# EAGLE design RPI_CAN (EAGLE 9.3.2)
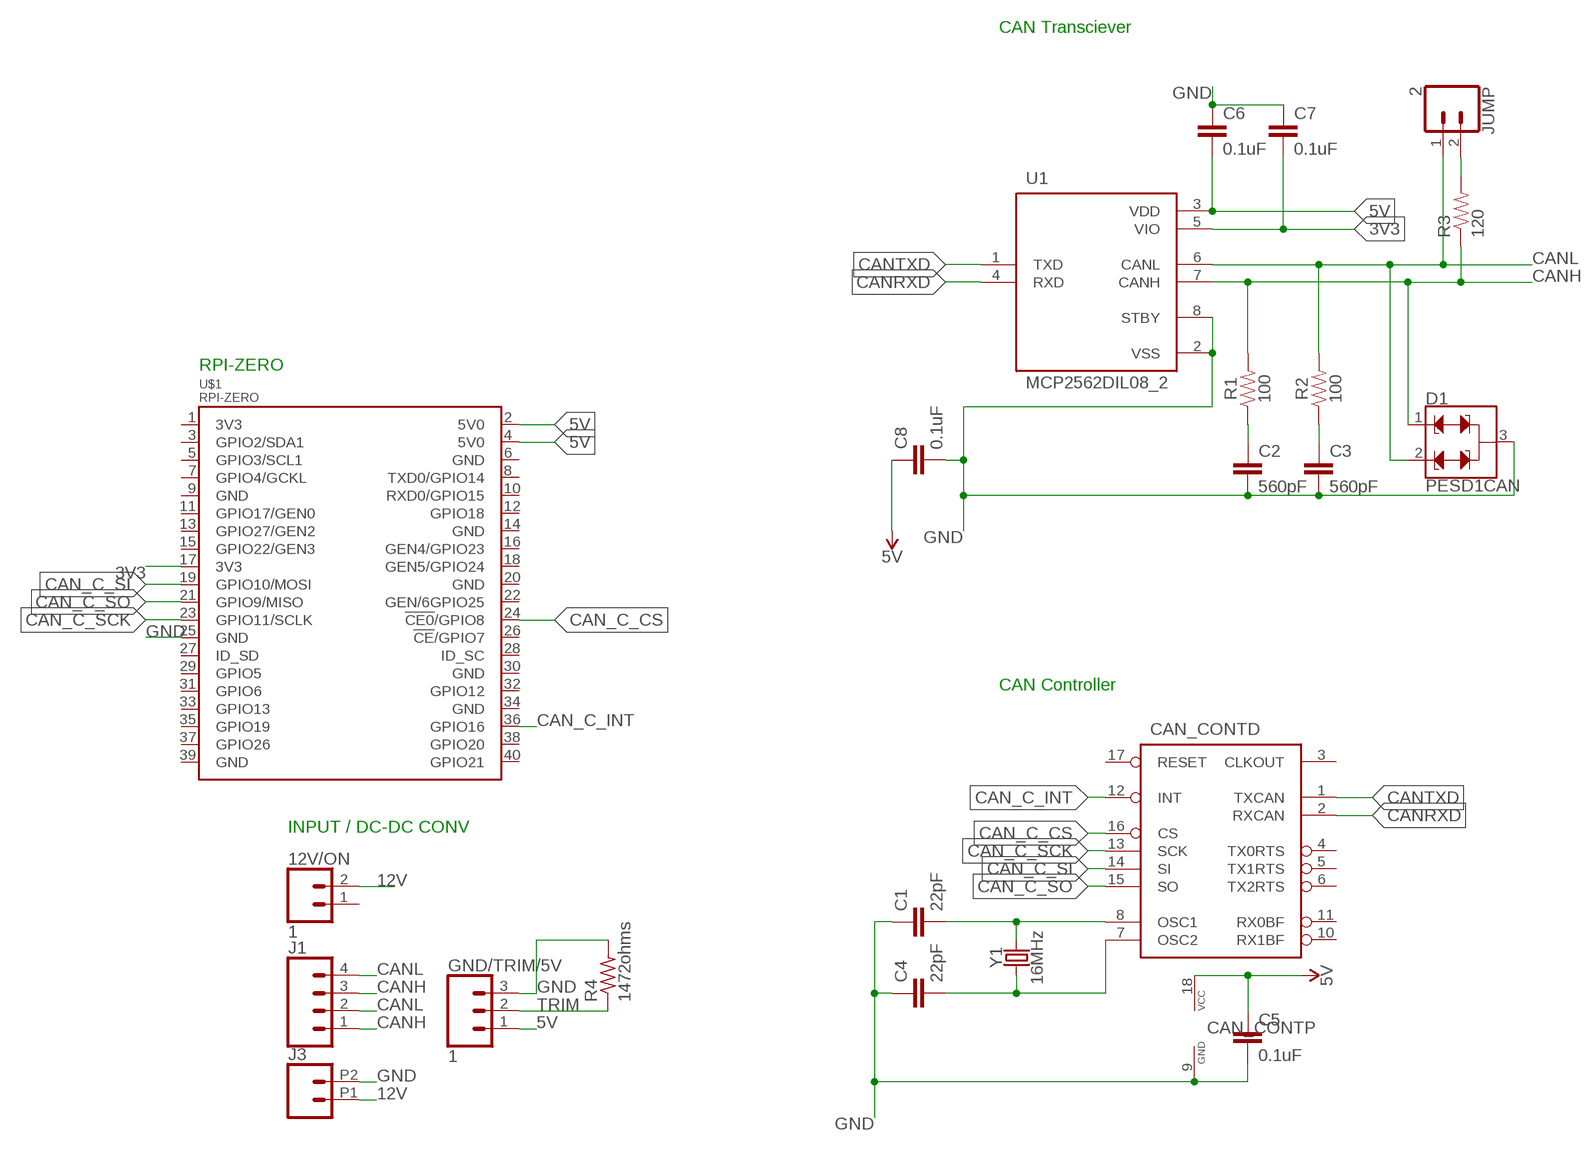
[diagram p0: schematic, sheet 1]

## Parts
12V/ON  1  CONN_02  [1X02]
C1  22pF  CAPKIT  [CAP-PTH-SMALL-KIT]
C2  560pF  CAPKIT  [CAP-PTH-SMALL-KIT]
C3  560pF  CAPKIT  [CAP-PTH-SMALL-KIT]
C4  22pF  CAPKIT  [CAP-PTH-SMALL-KIT]
C5  0.1uF  CAPKIT  [CAP-PTH-SMALL-KIT]
C6  0.1uF  CAPKIT  [CAP-PTH-SMALL-KIT]
C7  0.1uF  CAPKIT  [CAP-PTH-SMALL-KIT]
C8  0.1uF  CAPKIT  [CAP-PTH-SMALL-KIT]
CAN_CONT  MCP2515P  [DIL18]
D1  PESD1CAN  [SOT23-3]
GND/TRIM/5V  1  CONN_03  [1X03]
J1  CONN_04  [1X04]
J3  CONN_022.54MM_SCREWTERM  [1X02_2.54_SCREWTERM]
JUMP  2  CONN_02  [1X02]
R1  100  100OHM-HORIZ_KIT-1/4W-1%  [AXIAL-0.3EZ]
R2  100  100OHM-HORIZ_KIT-1/4W-1%  [AXIAL-0.3EZ]
R3  120  RESISTORAXIAL-0.3  [AXIAL-0.3]
R4  1472ohms  R-US_0204/5  [0204/5]
U1  MCP2562DIL08_2  [DIL08]
U$1  RPI-ZERO  [RASP_PI_ZERO_BOARD_FULL]
Y1  16MHz  CRYSTAL-16MHZPTH-HC49US  [HC49US]

## Nets
3V3: C7.2 U1.5(VIO) U$1.17(3V3)
5V: C5.1 C6.2 C8.1 CAN_CONT.18(P:VCC) GND/TRIM/5V.1 U1.3(VDD) U$1.2(5V0) U$1.4(5V0)
12V: 12V/ON.2 J3.P1
CAN_C_CS: CAN_CONT.16(D:CS) U$1.24(!CE0!/GPIO8)
CAN_C_INT: CAN_CONT.12(D:INT) U$1.36(GPIO16)
CAN_C_SCK: CAN_CONT.13(D:SCK) U$1.23(GPIO11/SCLK)
CAN_C_SI: CAN_CONT.14(D:SI) U$1.19(GPIO10/MOSI)
CAN_C_SO: CAN_CONT.15(D:SO) U$1.21(GPIO9/MISO)
CANH: D1.1 J1.1 J1.3 R1.P$2 R3.P$1 U1.7(CANH)
CANL: D1.2 J1.2 J1.4 JUMP.1 R2.P$2 U1.6(CANL)
CANRXD: CAN_CONT.2(D:RXCAN) U1.4(RXD)
CANTXD: CAN_CONT.1(D:TXCAN) U1.1(TXD)
GND: C1.1 C2.2 C3.2 C4.1 C5.2 C6.1 C7.1 C8.2 CAN_CONT.9(P:GND) D1.3 GND/TRIM/5V.3 J3.P2 R4.2 U1.2(VSS) U1.8(STBY) U$1.25(GND)
N$1: JUMP.2 R3.P$2
N$3: C2.1 R1.P$1
N$4: C3.1 R2.P$1
N$5: C1.2 CAN_CONT.8(D:OSC1) Y1.2
N$6: C4.2 CAN_CONT.7(D:OSC2) Y1.1
TRIM: GND/TRIM/5V.2 R4.1
Unconnected: 12V/ON.1 CAN_CONT.3(D:CLKOUT) CAN_CONT.4(D:TX0RTS) CAN_CONT.5(D:TX1RTS) CAN_CONT.6(D:TX2RTS) CAN_CONT.10(D:RX1BF) CAN_CONT.11(D:RX0BF) CAN_CONT.17(D:RESET) U$1.1(3V3) U$1.3(GPIO2/SDA1) U$1.5(GPIO3/SCL1) U$1.6(GND) U$1.7(GPIO4/GCKL) U$1.8(TXD0/GPIO14) U$1.9(GND) U$1.10(RXD0/GPIO15) U$1.11(GPIO17/GEN0) U$1.12(GPIO18) U$1.13(GPIO27/GEN2) U$1.14(GND) U$1.15(GPIO22/GEN3) U$1.16(GEN4/GPIO23) U$1.18(GEN5/GPIO24) U$1.20(GND) U$1.22(GEN/6GPIO25) U$1.26(!CE!/GPIO7) U$1.27(ID_SD) U$1.28(ID_SC) U$1.29(GPIO5) U$1.30(GND) U$1.31(GPIO6) U$1.32(GPIO12) U$1.33(GPIO13) U$1.34(GND) U$1.35(GPIO19) U$1.37(GPIO26) U$1.38(GPIO20) U$1.39(GND) U$1.40(GPIO21)

## Notes on the sheet
- CAN Transciever
- RPI-ZERO
- CAN Controller
- INPUT / DC-DC CONV

## Library data of the parts
12V/ON J3 JUMP = SparkFun-Connectors:CONN_02: Multi connection point. Often used as Generic Header-pin footprint for 0.1 inch spaced/style header connections On any of the 0.1 inch spaced packages, you can populate with these: Break Away Headers - Straight <https://www.sparkfun.com/products/116> (PRT-00116) Break Away Male Headers - Right Angle <https://www.sparkfun.com/products/553> (PRT-00553) Female Headers <https://www.sparkfun.com/products/115> (PRT-00115) Break Away Headers - Machine Pin <https://www.sparkfun.com/products/117> (PRT-00117) Break Away Female Headers - Swiss Machine Pin <https://www.sparkfun.com/products/743> (PRT-00743) For SCREWTERMINALS and SPRING TERMINALS visit here: Screw Terimnals on SparkFun.com <https://www.sparkfun.com/search/results?term=Screw+Terminals> (5mm/3.5mm/2.54mm spacing) This device is also useful as a general connection point to wire up your design to another part of your project. Our various solder wires solder well into these plated through hole pads. Hook-Up Wire - Assortment (Stranded, 22 AWG) <https://www.sparkfun.com/products/11375> (PRT-11375) Hook-Up Wire - Assortment (Solid Core, 22 AWG) <https://www.sparkfun.com/products/11367> (PRT-11367) View the entire wire category on our website here <https://www.sparkfun.com/categories/141> Special notes: Molex polarized connector foot print use with: PRT-08233 with associated crimp pins and housings. 2.54_SCREWTERM for use with PRT-10571. 3.5mm Screw Terminal footprints for PRT-08084 5mm Screw Terminal footprints for use with PRT-08432
C1-C8 = SparkFun:CAP: Capacitor Standard 0603 ceramic capacitor, and 0.1" leaded capacitor.
CAN_CONT = can:MCP2515: MC2515 Stand-Alone CAN Controller With SPI Interface, Microchip
D1 = SparkFun-DiscreteSemi:PESD1CAN: CAN bus ESD protection diode PESD1CAN is used to protect two CAN bus lines from ESD. Link to datasheet <http://www.nxp.com/documents/data_sheet/PESD1CAN-U.pdf> SparkFun Products: SparkFun CAN-BUS Shield <https://www.sparkfun.com/products/13262>; PROD_ID: DIO-12501
GND/TRIM/5V = SparkFun-Connectors:CONN_03: Multi connection point. Often used as Generic Header-pin footprint for 0.1 inch spaced/style header connections On any of the 0.1 inch spaced packages, you can populate with these: Break Away Headers - Straight <https://www.sparkfun.com/products/116> (PRT-00116) Break Away Male Headers - Right Angle <https://www.sparkfun.com/products/553> (PRT-00553) Female Headers <https://www.sparkfun.com/products/115> (PRT-00115) Break Away Headers - Machine Pin <https://www.sparkfun.com/products/117> (PRT-00117) Break Away Female Headers - Swiss Machine Pin <https://www.sparkfun.com/products/743> (PRT-00743) Stackable Header - 3 Pin (Female, 0.1") <https://www.sparkfun.com/products/13875> (PRT-13875) For SCREWTERMINALS and SPRING TERMINALS visit here: Screw Terimnals on SparkFun.com <https://www.sparkfun.com/search/results?term=Screw+Terminals> (5mm/3.5mm/2.54mm spacing) This device is also useful as a general connection point to wire up your design to another part of your project. Our various solder wires solder well into these plated through hole pads. Hook-Up Wire - Assortment (Stranded, 22 AWG) <https://www.sparkfun.com/products/11375> (PRT-11375) Hook-Up Wire - Assortment (Solid Core, 22 AWG) <https://www.sparkfun.com/products/11367> (PRT-11367) View the entire wire category on our website here <https://www.sparkfun.com/categories/141> Special notes: Molex polarized connector foot print use with SKU : PRT-08232 with associated crimp pins and housings.
J1 = SparkFun-Connectors:CONN_04: Multi connection point. Often used as Generic Header-pin footprint for 0.1 inch spaced/style header connections On any of the 0.1 inch spaced packages, you can populate with these: Break Away Headers - Straight <https://www.sparkfun.com/products/116> (PRT-00116) Break Away Male Headers - Right Angle <https://www.sparkfun.com/products/553> (PRT-00553) Female Headers <https://www.sparkfun.com/products/115> (PRT-00115) Break Away Headers - Machine Pin <https://www.sparkfun.com/products/117> (PRT-00117) Break Away Female Headers - Swiss Machine Pin <https://www.sparkfun.com/products/743> (PRT-00743) For SCREWTERMINALS and SPRING TERMINALS visit here: Screw Terimnals on SparkFun.com <https://www.sparkfun.com/search/results?term=Screw+Terminals> (5mm/3.5mm/2.54mm spacing) This device is also useful as a general connection point to wire up your design to another part of your project. Our various solder wires solder well into these plated through hole pads. Hook-Up Wire - Assortment (Stranded, 22 AWG) <https://www.sparkfun.com/products/11375> (PRT-11375) Hook-Up Wire - Assortment (Solid Core, 22 AWG) <https://www.sparkfun.com/products/11367> (PRT-11367) View the entire wire category on our website here <https://www.sparkfun.com/categories/141> Special notes: Molex polarized connector foot print use with SKU : PRT-08231 with associated crimp pins and housings. 1MM SMD Version SKU: PRT-10208; PROD_ID: CONN-09696
R1 R2 = SparkFun-Resistors:100OHM: 100Ω resistor A resistor is a passive two-terminal electrical component that implements electrical resistance as a circuit element. Resistors act to reduce current flow, and, at the same time, act to lower voltage levels within circuits. - Wikipedia; PROD_ID: RES-12181
R3 = SparkFun:RESISTOR: Resistor Basic schematic elements and footprints for 0603, 1206, and PTH resistors.
R4 = adafruit:R-US_: RESISTOR, American symbol
U1 = can:MCP2562
U$1 = rpi-zero:RPI-ZERO
Y1 = SparkFun-Clocks:CRYSTAL-16MHZ: 16MHz Crystal Digikey Example <http://www.digikey.com/product-search/en?keywords=535-9122-1-ND> Frequency: 16MHz Frequency Stability: ±50ppm Frequency Tolerance: ±20ppm Load Capacitance: 18pF SparkFun Products: Pro Micro -5V/16MHz <https://www.sparkfun.com/products/12640> SparkFun Serial Enabled LCD Kit <https://www.sparkfun.com/products/10097>; PROD_ID: XTAL-08181; SF_ID: COM-00536

## Board
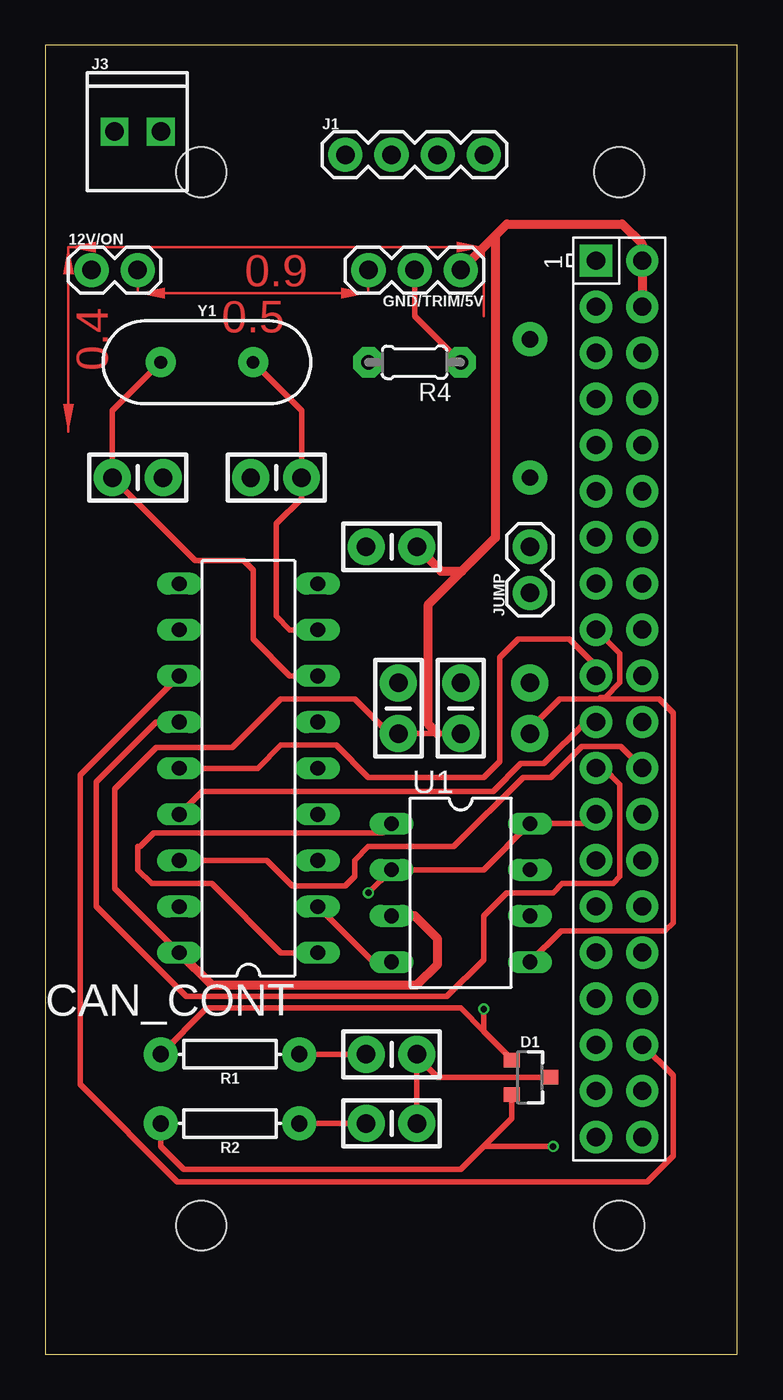
[diagram p1: board, top side]
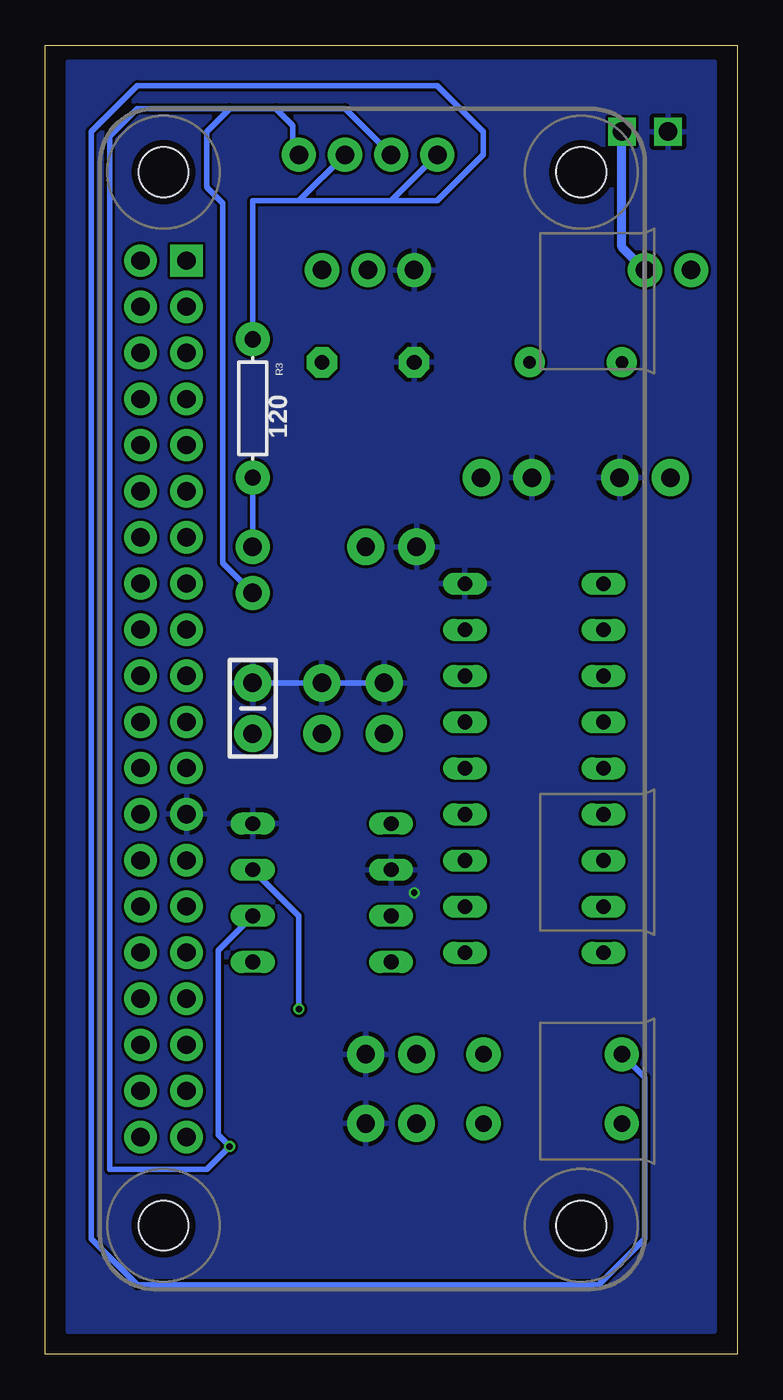
[diagram p2: board, bottom side, seen from below]

Size 38.08 x 72.06 mm. Coordinates in mm from the lower left corner, seen from the top.
Outline: 0,0 38.08,0 38.08,72.06 0,72.06 0,0
Copper layers (1*16): Top 0.035559375mm / dielectric 1.6mm / Bottom 0.035559375mm
Design rules "oshpark_2layer": minimum track width 6mil, minimum drill 10mil, track to track 6mil, track to pad 6mil, pad to pad 6mil, via to via 6mil, smd to smd 6mil, copper to edge 15mil, drill to drill 6mil, minimum pad ring 5mil, minimum via ring 5mil, stop-mask expansion 2.5mil, vias tented up to drill 0mil, thermal gap 10mil

### Footprints (pad centres in the part's own frame; a part is rotated, then mirrored left to right if it is on the bottom)
1X02 = drill 1.016 pad 1.88: 1 0,0; 2 2.54,0
CAP-PTH-SMALL-KIT = drill 1.016 pad 2.032: 1 -1.397,0; 2 1.397,0
DIL18 = drill 0.813 long: 1 -10.16,-3.81; 2 -7.62,-3.81; 3 -5.08,-3.81; 4 -2.54,-3.81; 5 0,-3.81; 6 2.54,-3.81; 7 5.08,-3.81; 8 7.62,-3.81; 9 10.16,-3.81; 10 10.16,3.81; 11 7.62,3.81; 12 5.08,3.81; 13 2.54,3.81; 14 0,3.81; 15 -2.54,3.81; 16 -5.08,3.81; 17 -7.62,3.81; 18 -10.16,3.81
SOT23-3 = smd 0.8 x 0.9: 1 -0.95,-1; 2 0.95,-1; 3 0,1.1
1X03 = drill 1.016 pad 1.88: 1 0,0; 2 2.54,0; 3 5.08,0
1X04 = drill 1.016 pad 1.88: 1 0,0; 2 2.54,0; 3 5.08,0; 4 7.62,0
1X02_2.54_SCREWTERM = drill 1.016 square: P1 2.54,0; P2 0,0
AXIAL-0.3EZ = drill 0.9 pad 1.88: P$1 -3.81,0; P$2 3.81,0
AXIAL-0.3 = drill 0.9 pad 1.88: P$1 -3.81,0; P$2 3.81,0
0204/5 = drill 0.813 pad 1.676 octagon: 1 -2.54,0; 2 2.54,0
DIL08 = drill 0.813 long: 1 -3.81,-3.81; 2 -1.27,-3.81; 3 1.27,-3.81; 4 3.81,-3.81; 5 3.81,3.81; 6 1.27,3.81; 7 -1.27,3.81; 8 -3.81,3.81
RASP_PI_ZERO_BOARD_FULL = drill 1 pad 1.778 square: 1 8.37,25.23 | drill 1 pad 1.778: 2 8.37,27.77; 3 10.91,25.23; 4 10.91,27.77; 5 13.45,25.23; 6 13.45,27.77; 7 15.99,25.23; 8 15.99,27.77; 9 18.53,25.23; 10 18.53,27.77; 11 21.07,25.23; 12 21.07,27.77; 13 23.61,25.23; 14 23.61,27.77; 15 26.15,25.23; 16 26.15,27.77; 17 28.69,25.23; 18 28.69,27.77; 19 31.23,25.23; 20 31.23,27.77; 21 33.77,25.23; 22 33.77,27.77; 23 36.31,25.23; 24 36.31,27.77; 25 38.85,25.23; 26 38.85,27.77; 27 41.39,25.23; 28 41.39,27.77; 29 43.93,25.23; 30 43.93,27.77; 31 46.47,25.23; 32 46.47,27.77; 33 49.01,25.23; 34 49.01,27.77; 35 51.55,25.23; 36 51.55,27.77; 37 54.09,25.23; 38 54.09,27.77; 39 56.63,25.23; 40 56.63,27.77 | hole 2.75: 3.5,3.5; 3.5,26.5; 61.5,3.5; 61.5,26.5
HC49US = drill 0.7 pad 1.651: 1 -2.54,0; 2 2.54,0

### Placement (x,y rotation side)
12V/ON  2.54,59.69 0 top
C1  12.7,48.26 0 top
C2  19.05,16.51 0 top
C3  19.05,12.7 0 top
C4  5.08,48.26 180 top
C5  22.86,35.56 90 top
C6  19.43,35.56 270 top
C7  26.67,35.56 270 bottom
C8  19.05,44.45 180 top
CAN_CONT  11.18,32.26 90 top
D1  26.67,15.24 270 top
GND/TRIM/5V  22.86,59.69 180 top
J1  16.51,66.04 0 top
J3  3.81,67.31 0 top
JUMP  26.67,41.91 90 top
R1  10.16,16.51 180 top
R2  10.16,12.7 180 top
R3  26.67,52.07 270 bottom
R4  20.32,54.61 180 top
U1  22.86,25.4 270 top
U$1  5.08,68.58 270 top
Y1  8.89,54.61 0 top

### Tracks (layer width: path | path; a pad name or v marks a point on that pad's centre or on a via)
3V3
  Top 0.305: U1.5 28.38,23.3 34.1,23.3 34.54,23.75 34.54,35.31 33.78,36.07 30.48,36.07 | 30.48,36.07 28.32,36.07 26.67,34.42 C7.2 | 30.48,36.07 30.57,36.16 30.8,36.16 31.62,36.98 31.62,38.58 U$1.17
5V
  Top 0.305: CAN_CONT.18 3.81,25.65 3.81,31.11 6.1,33.4 10.29,33.4 12.95,36.07 17.02,36.07 18.92,34.16 C6.2 21.59,34.16 C5.1
  Top 0.508: GND/TRIM/5V.1 24.77,61.59 | 24.77,61.59 25.4,62.23 31.75,62.23 32.85,61.13 U$1.2 U$1.4 | 24.77,61.59 24.77,44.96 22.92,43.12 | CAN_CONT.18 9.14,20.32 20.45,20.32 21.59,21.46 21.59,22.86 20.32,24.13 U1.3 | 22.92,43.12 21.08,41.27 21.08,34.67 21.59,34.16 | C8.1 21.78,43.12 22.92,43.12
12V
  Bottom 0.508: 12V/ON.2 6.35,60.96 J3.P1
CAN_C_CS
  Top 0.305: CAN_CONT.16 12.19,27.18 13.59,25.78 16.51,25.78 17.02,26.29 17.02,27.18 17.78,27.94 22.48,27.94 26.29,31.75 27.81,31.75 29.53,33.46 31.66,33.46 U$1.24
CAN_C_INT
  Top 0.305: CAN_CONT.12 1.91,31.88 1.91,14.86 7.27,9.5 33.12,9.5 34.54,10.92 34.54,15.34 U$1.36
CAN_C_SCK
  Top 0.305: CAN_CONT.13 6.1,34.8 2.79,31.5 2.79,24.64 7.75,19.68 22.1,19.68 24.13,21.72 24.13,24.13 25.4,25.4 27.94,25.4 28.45,25.91 31.24,25.91 31.62,26.29 31.62,31.37 30.72,32.27 U$1.23
CAN_C_SI
  Top 0.305: CAN_CONT.14 11.68,32.26 12.95,33.53 16,33.53 17.78,31.75 24.13,31.75 25.02,32.64 25.02,38.35 26.04,39.37 28.83,39.37 30.31,37.89 U$1.19
CAN_C_SO
  Top 0.305: CAN_CONT.15 8.64,30.99 24.64,30.99 26.16,32.51 27.43,32.51 29.73,34.81 U$1.21
CANH  (via drill 0.35)
  Top 0.305: R1.P$2 8.89,19.05 22.86,19.05 24.13,17.78 | 24.13,17.78 25.67,16.24 D1.1 | v24.13,19 24.13,17.78
  Bottom 0.305: R3.P$1 26.67,63.5 24.13,63.5 | U1.7 24.13,24.13 v24.13,19 | R1.P$2 5.08,15.24 5.08,6.35 7.62,3.81 33.02,3.81 35.56,6.35 35.56,67.31 33.02,69.85 16.51,69.85 13.97,67.31 13.97,66.04 16.51,63.5 19.05,63.5 | 24.13,63.5 19.05,63.5 | J1.1 19.05,63.5 | J1.3 24.13,63.5
CANL  (via drill 0.35)
  Top 0.305: R2.P$2 6.35,11.43 7.62,10.16 22.86,10.16 24.13,11.43 | D1.2 25.67,12.97 24.13,11.43 | v27.94,11.43 24.13,11.43
  Bottom 0.305: U1.6 28.57,22.23 28.57,12.06 v27.94,11.43 29.21,10.16 34.54,10.16 34.54,67.06 33.02,68.58 27.94,68.58 | JUMP.1 28.32,43.56 28.32,63.37 29.21,64.26 29.21,67.31 27.94,68.58 | 27.94,68.58 25.4,68.58 | 25.4,68.58 24.47,67.65 24.47,66.38 J1.4 | 25.4,68.58 21.59,68.58 J1.2
CANRXD
  Top 0.305: CAN_CONT.2 18.03,21.59 U1.4
CANTXD
  Top 0.305: CAN_CONT.1 12.95,22.1 9.14,25.91 5.84,25.91 5.08,26.67 5.08,27.94 5.21,27.94 5.97,28.7 18.54,28.7 U1.1
GND  (via drill 0.35)
  Top 0.305: U$1.25 29.79,29.21 U1.8 24.13,26.67 U1.2 v17.78,25.4 | D1.3 21.59,15.24 20.45,16.38 C2.2 C3.2
  Bottom 0.305: C7.1 C5.2 C6.1
  pour Bottom: 1.27,71.12 1.27,1.27 36.83,1.27 36.83,71.12
N$1
  Bottom 0.305: R3.P$2 JUMP.2
N$3
  Top 0.305: R1.P$1 C2.1
N$4
  Top 0.305: C3.1 R2.P$1
N$5
  Top 0.305: CAN_CONT.8 13.46,39.88 12.7,40.64 12.7,45.72 14.1,47.12 C1.2 14.1,51.94 Y1.2
N$6
  Top 0.305: CAN_CONT.7 13.46,37.34 11.43,39.37 11.43,43.18 10.92,43.69 8.89,43.69 8.26,43.69 C4.2 3.68,51.94 Y1.1
TRIM
  Top 0.305: R4.1 20.32,57.15 GND/TRIM/5V.2
(copper drawn outside any net)
  shapes: Top area x3